# EAGLE design ctrl_encoder (EAGLE 6.6.0)
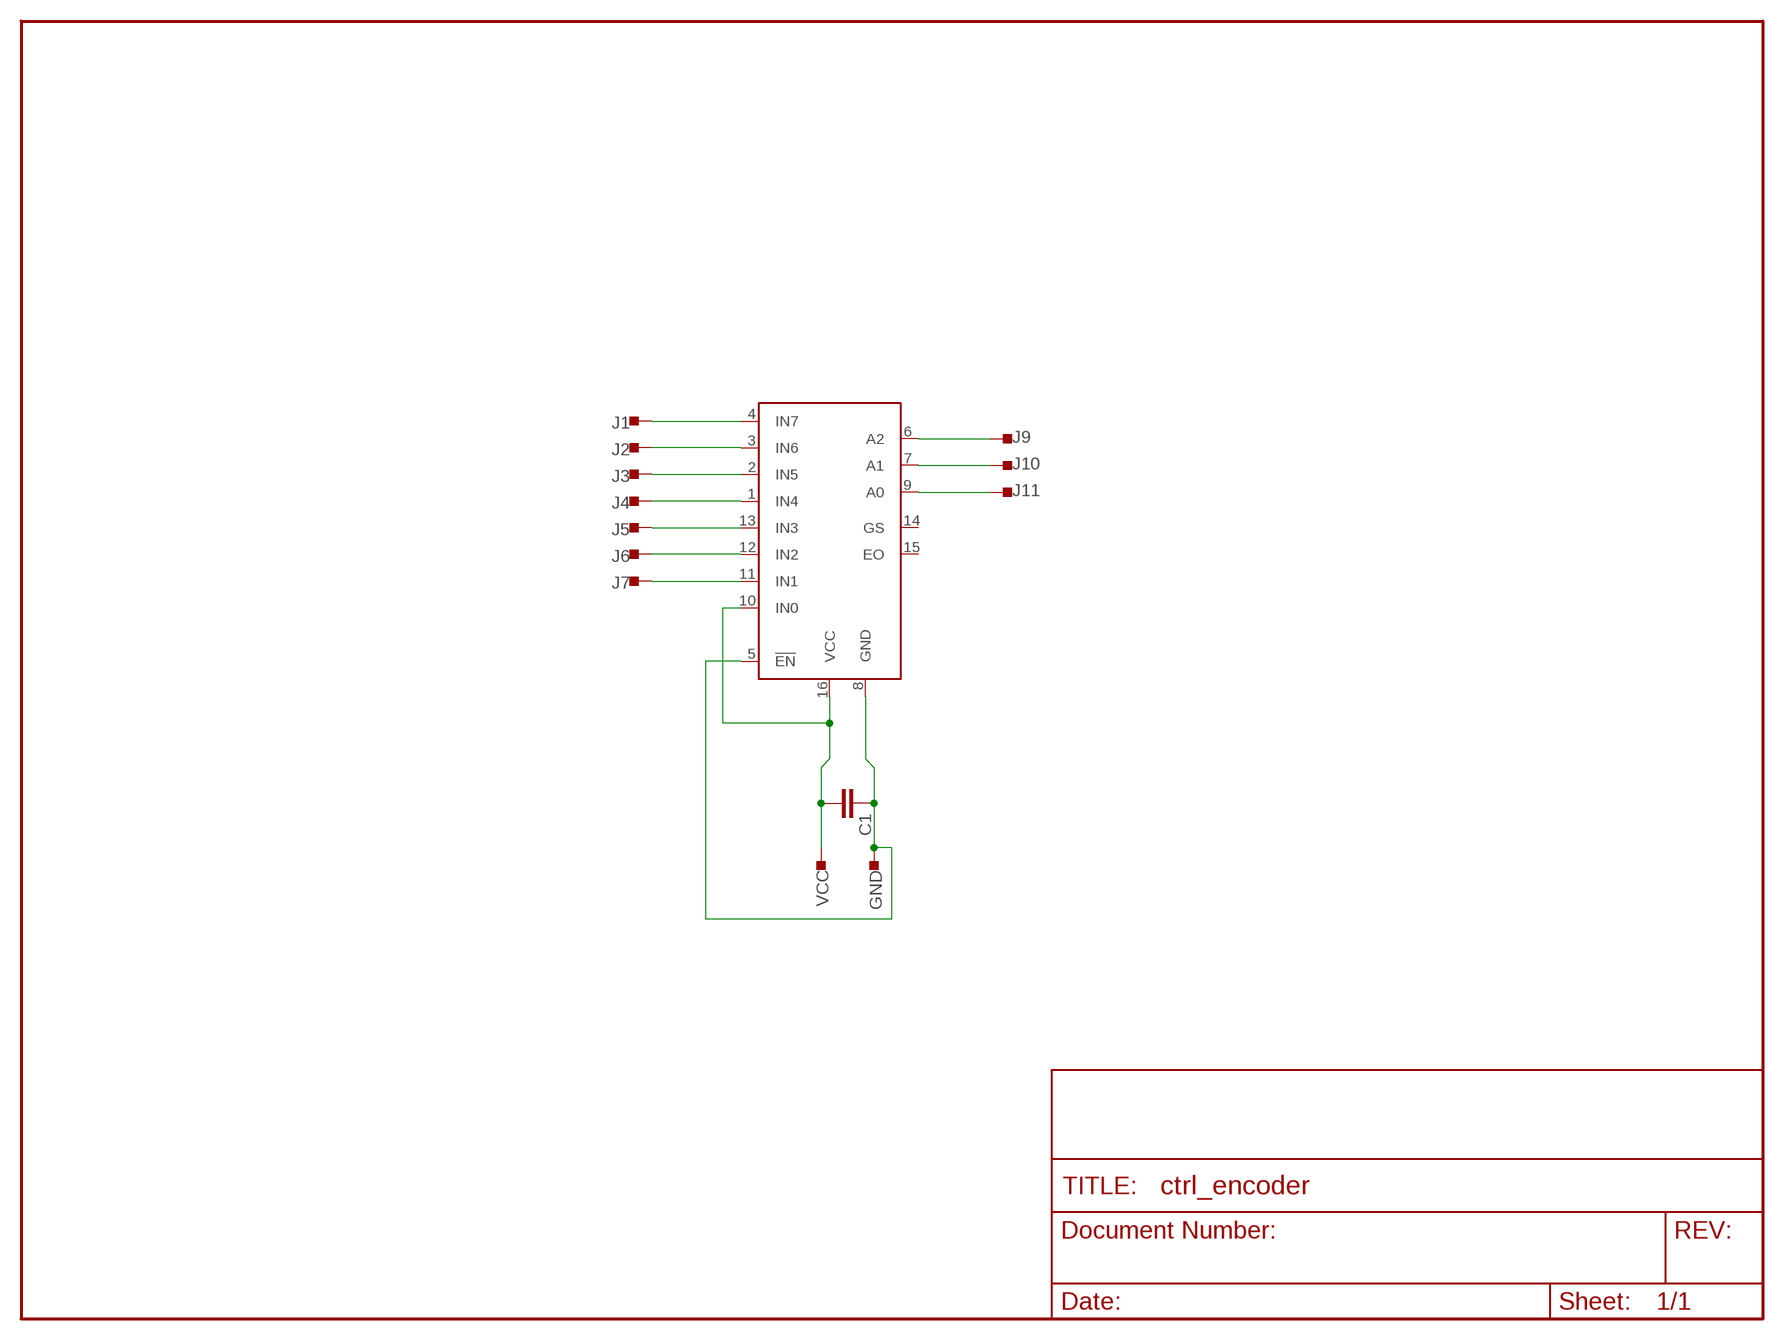
[diagram p0: schematic, sheet 1]

## Parts
C1  C  [C0805]
GND  PAD  [TEST_PAD]
J1  PAD  [TEST_PAD]
J2  PAD  [TEST_PAD]
J3  PAD  [TEST_PAD]
J4  PAD  [TEST_PAD]
J5  PAD  [TEST_PAD]
J6  PAD  [TEST_PAD]
J7  PAD  [TEST_PAD]
J9  PAD  [TEST_PAD]
J10  PAD  [TEST_PAD]
J11  PAD  [TEST_PAD]
U$1  SN74HC148DR  [SO16]
VCC  PAD  [TEST_PAD]

## Nets
GND: C1.1 GND.P$1(PAD) U$1.5(!EN) U$1.8(GND)
N$1: C1.2 U$1.10(IN0) U$1.16(VCC) VCC.P$1(PAD)
N$2: J9.P$1(PAD) U$1.6(A2)
N$3: J1.P$1(PAD) U$1.4(IN7)
N$4: J2.P$1(PAD) U$1.3(IN6)
N$5: J3.P$1(PAD) U$1.2(IN5)
N$6: J4.P$1(PAD) U$1.1(IN4)
N$7: J5.P$1(PAD) U$1.13(IN3)
N$8: J6.P$1(PAD) U$1.12(IN2)
N$9: J7.P$1(PAD) U$1.11(IN1)
N$11: J10.P$1(PAD) U$1.7(A1)
N$12: J11.P$1(PAD) U$1.9(A0)
Unconnected: U$1.14(GS) U$1.15(EO)

## Library data of the parts
C1 = LockBox:C: CAPACITOR, European symbol; SPICEMODEL: NONE; SPICEPREFIX: C
GND J1-J7 J9-J11 VCC = LockBox:PAD: Through hole test pad; DIAM: 0.6mm
U$1 = LockBox:SN74HC148: 8-Line to 3-Line Priority Encoder Features priority decoding of the inputs to ensure that only the highest-order dataline is encoded Source: http://www.ti.com/lit/ds/symlink/sn74hc148.pdf

## Board
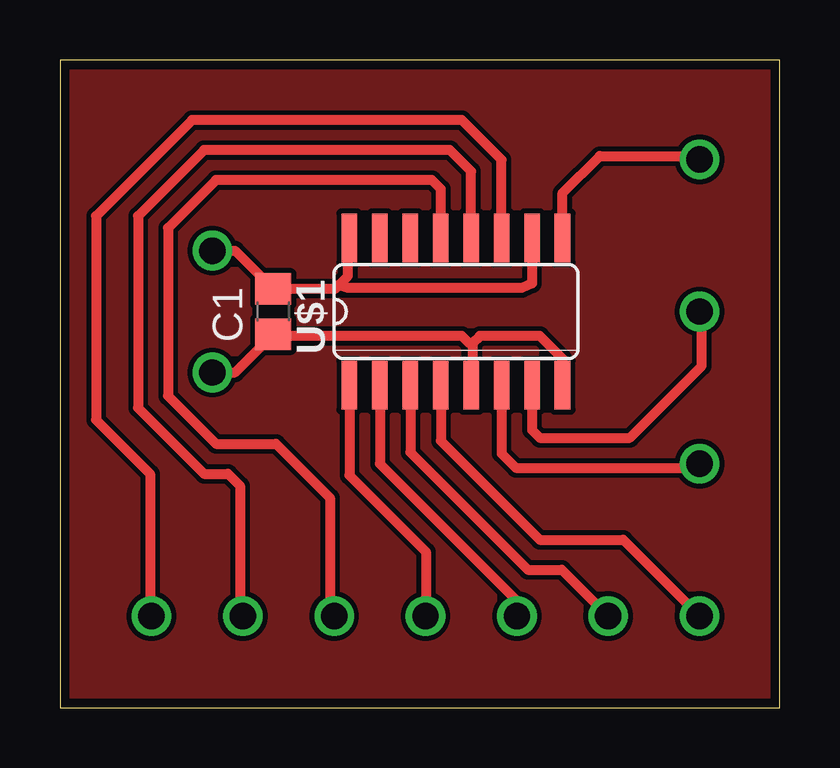
[diagram p1: board, top side]

Size 30 x 27 mm. Coordinates in mm from the lower left corner, seen from the top.
Outline: 0,0 30,0 30,27 0,27 0,0
Copper layers (1*16): Top 0.0178mm / dielectric 59mil / Bottom 0.0178mm
Design rules "epl-lpkf": minimum track width 8mil, minimum drill 0.35mm, track to track 8mil, track to pad 8mil, pad to pad 8mil, via to via 8mil, smd to smd 8mil, copper to edge 15mil, drill to drill 15mil, minimum pad ring 8mil, minimum via ring 8mil, stop-mask expansion 3mil, vias tented up to drill 0mil, thermal gap 10mil

### Footprints (pad centres in the part's own frame; a part is rotated, then mirrored left to right if it is on the bottom)
C0805 = smd 1.3 x 1.5: 1 -0.95,0; 2 0.95,0
TEST_PAD = drill 1.1: P$1 0,0
SO16 = smd 0.66 x 2.032: 1 -4.445,-3.073; 2 -3.175,-3.073; 3 -1.905,-3.073; 4 -0.635,-3.073; 5 0.635,-3.073; 6 1.905,-3.073; 7 3.175,-3.073; 8 4.445,-3.073; 9 4.445,3.073; 10 3.175,3.073; 11 1.905,3.073; 12 0.635,3.073; 13 -0.635,3.073; 14 -1.905,3.073; 15 -3.175,3.073; 16 -4.445,3.073

### Placement (x,y rotation side)
C1  8.89,16.51 90 top
GND  6.35,13.97 90 top
J1  26.67,3.81 90 top
J2  22.86,3.81 90 top
J3  19.05,3.81 90 top
J4  15.24,3.81 90 top
J5  11.43,3.81 90 top
J6  7.62,3.81 90 top
J7  3.81,3.81 90 top
J9  26.67,10.16 90 top
J10  26.67,16.51 90 top
J11  26.67,22.86 90 top
U$1  16.51,16.51 0 top
VCC  6.35,19.05 90 top

### Tracks (layer width: path | path; a pad name or v marks a point on that pad's centre or on a via)
GND
  Top 0.406: GND.P$1 7.3,13.97 C1.1 8.95,15.5 16.75,15.5 17.05,15.2 17.2,15.2 | U$1.8 20.95,14.54 20,15.5 17.5,15.5 17.2,15.2 | 17.2,15.2 17.2,13.49 U$1.5
N$1
  Top 0.406: VCC.P$1 7.3,19.05 C1.2 11.46,17.46 11.62,17.62 | 11.62,17.62 12,18 12,19.52 U$1.16 | U$1.10 19.68,17.68 19.25,17.5 12,17.5 11.62,17.62
N$2
  Top 0.406: U$1.6 18.41,10.59 19,10 26.51,10 J9.P$1
N$3
  Top 0.406: U$1.4 15.88,11.12 20,7 23.48,7 J1.P$1
N$4
  Top 0.406: U$1.3 14.61,10.64 19.5,5.75 20.92,5.75 J2.P$1
N$5
  Top 0.406: U$1.2 13.34,10.16 19,4.5 19,3.86 J3.P$1
N$6
  Top 0.406: U$1.1 12.06,9.69 15.25,6.5 J4.P$1
N$7
  Top 0.406: U$1.13 15.88,21.62 15.5,22 6.5,22 4.5,20 4.5,13 6.5,11 9,11 11.25,8.75 11.25,3.99 J5.P$1
N$8
  Top 0.406: U$1.12 17.14,22.36 16.25,23.25 6,23.25 3.25,20.5 3.25,12.5 6,9.75 7,9.75 7.5,9.25 7.5,3.93 J6.P$1
N$9
  Top 0.406: U$1.11 18.41,22.84 16.75,24.5 5.5,24.5 1.5,20.5 1.5,12 3.75,9.75 3.75,3.87 J7.P$1
N$10
  pour Top (isolate 0.2): 0,27 0,0 30,0 30,27
N$11
  Top 0.406: U$1.7 19.68,11.56 20,11.25 23.75,11.25 26.75,14.25 26.75,16.43 J10.P$1
N$12
  Top 0.406: U$1.9 20.95,21.45 22.5,23 26.53,23 J11.P$1